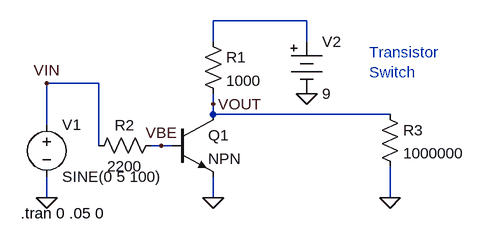
[diagram p0: schematic lab05a-Trans-switch.asc]
lab05a-Trans-switch.asc, the LTspice schematic file:
Version 4
SHEET 1 880 680
WIRE 384 16 240 16
WIRE 240 48 240 16
WIRE 384 48 384 16
WIRE 64 112 -16 112
WIRE 240 144 240 128
WIRE 240 160 240 144
WIRE 512 160 240 160
WIRE -16 176 -16 112
WIRE 64 208 64 112
WIRE 160 208 144 208
WIRE 176 208 160 208
WIRE -16 288 -16 256
WIRE 240 288 240 256
WIRE 512 288 512 240
FLAG 240 288 0
FLAG -16 288 0
FLAG -16 112 VIN
FLAG 240 144 VOUT
FLAG 512 288 0
FLAG 384 128 0
FLAG 160 208 VBE
SYMBOL voltage -16 160 R0
WINDOW 123 0 0 Left 0
WINDOW 39 0 0 Left 0
SYMATTR InstName V1
SYMATTR Value SINE(0 5 100)
SYMBOL npn 176 160 R0
SYMATTR InstName Q1
SYMBOL res 224 32 R0
SYMATTR InstName R1
SYMATTR Value 1000
SYMBOL res 160 192 R90
WINDOW 0 0 56 VBottom 0
WINDOW 3 32 56 VTop 0
SYMATTR InstName R2
SYMATTR Value 2200
SYMBOL Misc\\battery 384 32 R0
WINDOW 123 0 0 Left 0
WINDOW 39 0 0 Left 0
SYMATTR InstName V2
SYMATTR Value 9
SYMBOL res 496 144 R0
SYMATTR InstName R3
SYMATTR Value 1000000
TEXT -56 312 Left 0 !.tran 0 .05 0
TEXT 480 64 Left 0 ;Transistor\nSwitch

The netlist it stands for:
* lab05a-Trans-switch.asc
V1 VIN 0 SINE(0 5 100)
Q1 VOUT VBE 0 0 NPN
R1 N001 VOUT 1000
R2 VBE VIN 2200
V2 N001 0 9
R3 VOUT 0 1000000
.model NPN NPN
.model PNP PNP
.lib standard.bjt
.tran 0 .05 0
* Transistor
* Switch
.backanno
.end